# Altium project SeniorProject.PrjPCB
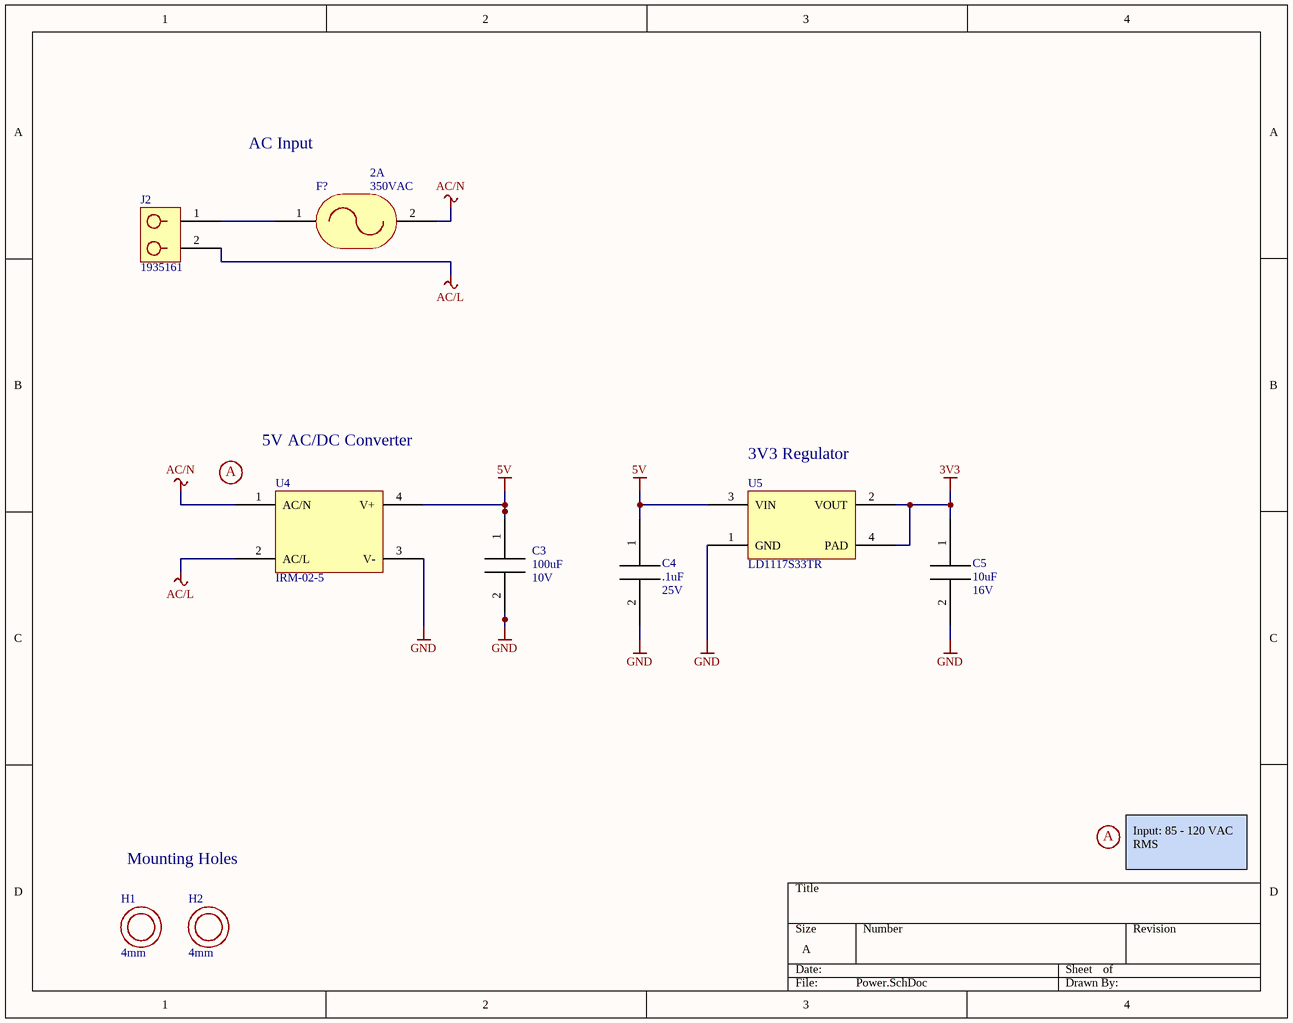
[diagram p0: Power.SchDoc]
3 sheets, 22 parts. Net scope: global (net labels, ports and power ports of the same name join across sheets).
Board file: LightSwitch.PcbDoc
Sheets:
  Power.SchDoc
  Dimmer.SchDoc
  XBee.SchDoc

## Sheet Power.SchDoc
size A

### Parts
C3  value 100uF  Rating: 10V  [1206]  (hidden comment: CAP)
C4  value .1uF  Rating: 25V  [1206]  (hidden comment: CAP)
C5  value 10uF  Rating: 16V  [1206]  (hidden comment: CAP)
F?  value 2A  Rating: 350VAC  [0697H]  (hidden comment: F_FUSE_0697H)
H1  value 4mm  [MOUNTHOLE4MM]  (hidden comment: H_MOUNTHOLE_MOUNTHOLE4MM)
H2  value 4mm  [MOUNTHOLE4MM]  (hidden comment: H_MOUNTHOLE_MOUNTHOLE4MM)
J2  1935161  [1935161]
U4  IRM-02-5  [IRM-02-5]
U5  LD1117S33TR  [SOT223]

### Nets
3V3: C5.1 U5.2(VOUT) U5.4(PAD)
5V: C3.1 C4.1 U4.4(V+) U5.3(VIN)
AC/L: J2.2 U4.2(AC/L)
AC/N: F?.2 U4.1(AC/N)
GND: C3.2 C4.2 C5.2 U4.3(V-) U5.1(GND)
NetF?_1: F?.1 J2.1

### Notes on the sheet
- AC Input
- (near U4) A
- 5V AC/DC Converter
- (near U5) 3V3 Regulator
- A
- Mounting Holes
- Input: 85 - 120 VAC RMS

### Library data of the parts
C3-C5 = C_CAP_1206
J2 = J_2POSTERM_1935161
U4 = U_IRM-02-5_IRM-02-5
U5 = U_LD1117S33TR_SOT223

## Sheet Dimmer.SchDoc
size A4
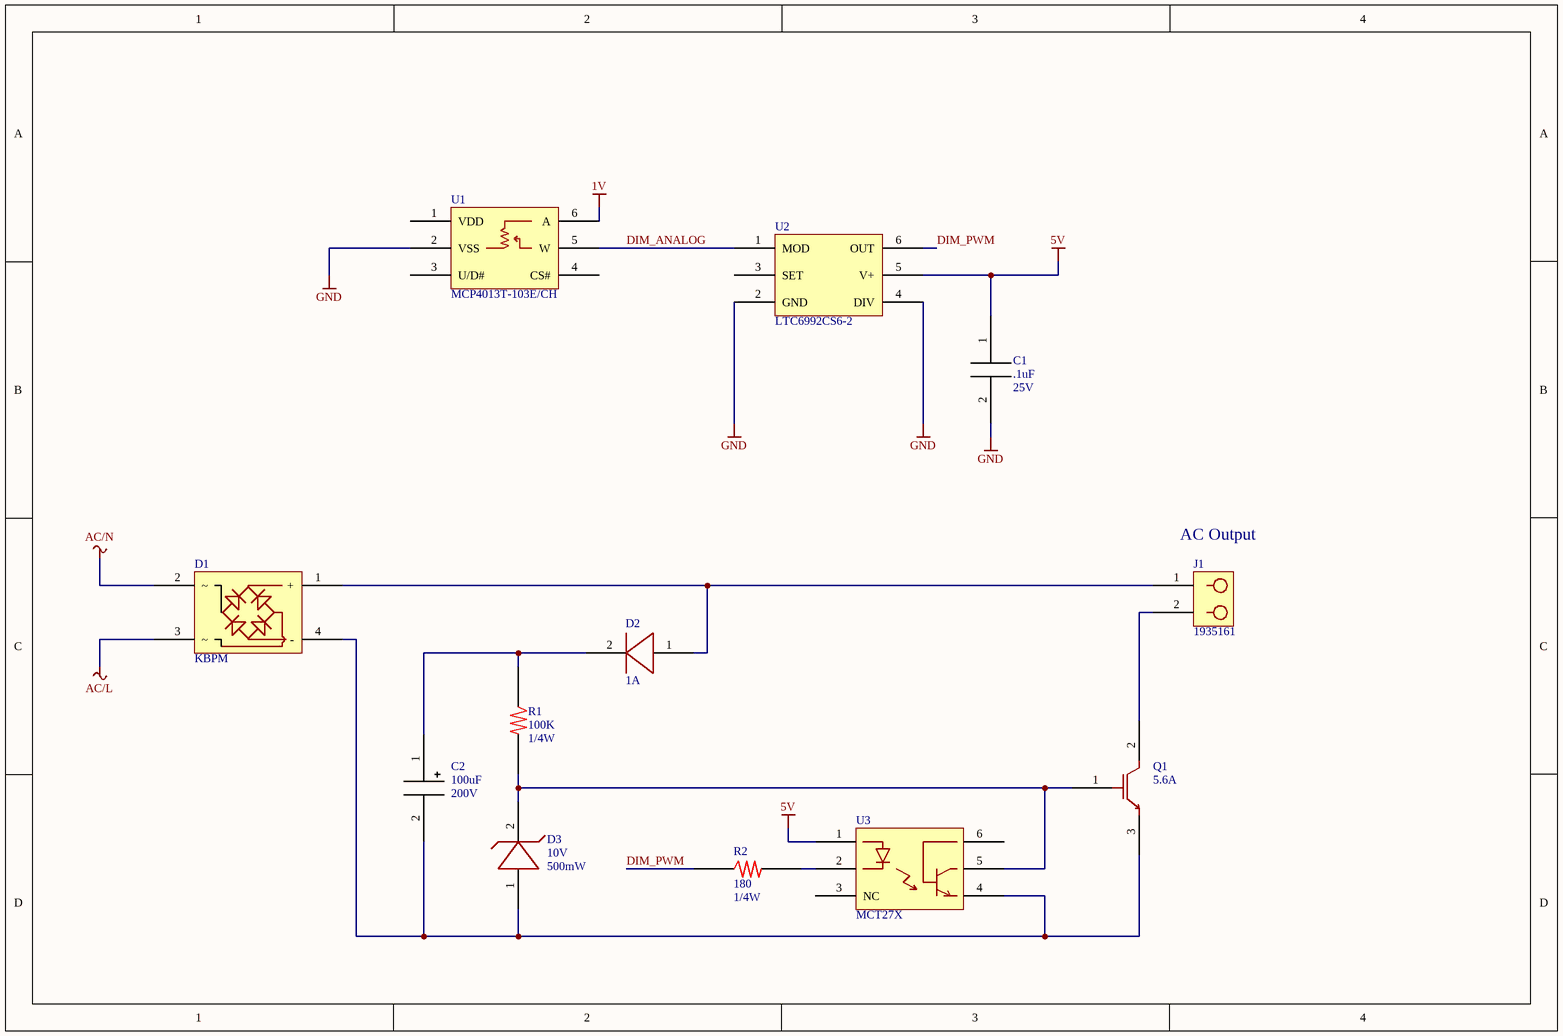
[diagram p1: Dimmer.SchDoc]

### Parts
C1  value .1uF  Rating: 25V  [1206]  (hidden comment: CAP)
C2  value 100uF  Rating: 200V  [CAPM7]  (hidden comment: CAP)
D1  KBPM  [KBPM]
D2  Rating: 1A  [DO41]  (hidden comment: DIODE)
D3  value 10V  Rating: 500mW  [DO35]  (hidden comment: ZENER)
J1  1935161  [1935161]
Q1  Rating: 5.6A  [TO-220AB]  (hidden comment: Q_IRF510_TO-220AB)
R1  value 100K  Rating: 1/4W  [1206]  (hidden comment: R_RES_1206)
R2  value 180  Rating: 1/4W  [1206]  (hidden comment: R_RES_1206)
U1  MCP4013T-103E/CH  [SOT23-6]
U2  LTC6992CS6-2  [SOT23-6]
U3  MCT27X  [DIP6]

### Nets
1V: U1.6(A)
5V: C1.1 U2.5(V+) U3.1
AC/L: D1.3
AC/N: D1.2
GND: C1.2 U1.2(VSS) U2.2(GND) U2.4(DIV)
DIM_ANALOG: U1.5(W) U2.1(MOD)
DIM_PWM: R2.1 U2.6(OUT)
NetC2_1: C2.1 D2.2 R1.1
NetC2_2: C2.2 D1.4(-) D3.1 Q1.3(S) U3.4
NetD1_1: D1.1(+) D2.1 J1.1
NetD3_2: D3.2 Q1.1(G) R1.2 U3.5
NetJ1_2: J1.2 Q1.2(D)
NetR2_2: R2.2 U3.2

Not connected (* = marked no-connect by the designer): U1 1(VDD) 3(U/D#) 4(CS#); U2 3(SET); U3 3(NC) 6

### Notes on the sheet
- (near J1) AC Output

### Library data of the parts
C1 = C_CAP_1206
C2 = C_CAPP_CAPM7
D1 = D_KBPM_KBMP
D2 = D_DIODE_DO41
D3 = D_ZENER_DO35
J1 = J_2POSTERM_1935161
U1 = U_ MCP4013T-103E/CH_SOT23-6
U2 = U_LTC6992CS6-2_SOT23-6
U3 = U_MCT27X_DIP6

## Sheet XBee.SchDoc
size A
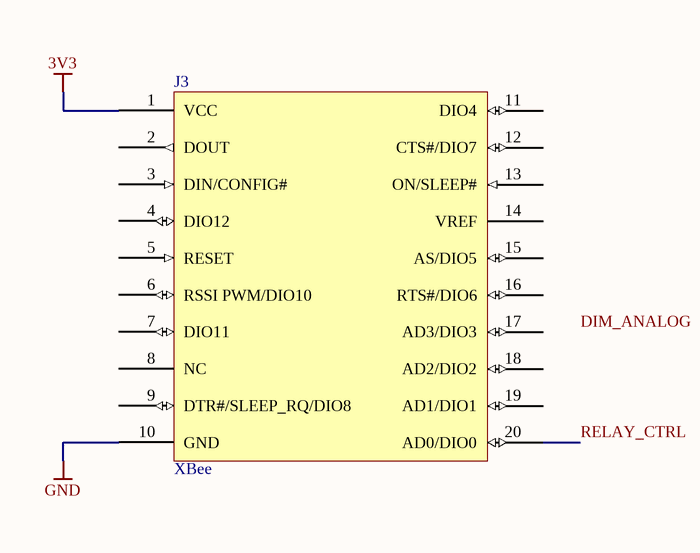
[diagram p2: XBee.SchDoc]

### Parts
J3  XBee  [XBEE]

### Nets
3V3: J3.1(VCC)
GND: J3.10(GND)
RELAY_CTRL: J3.20(AD0/DIO0)

Not connected (* = marked no-connect by the designer): J3 2(DOUT) 3(DIN/CONFIG#) 4(DIO12) 5(RESET) 6(RSSI_PWM/DIO10) 7(DIO11) 8(NC) 9(DTR#/SLEEP_RQ/DIO8) 11(DIO4) 12(CTS#/DIO7) 13(ON/SLEEP#) 14(VREF) 15(AS/DIO5) 16(RTS#/DIO6) 17(AD3/DIO3) 18(AD2/DIO2) 19(AD1/DIO1)

### Notes on the sheet
- Labels drawn without touching a wire or pin: DIM_ANALOG

### Library data of the parts
J3 = J_XBEE_XBEE

## Nets that join several sheets
3V3: Power (C5.1 U5.2 U5.4), XBee (J3.1)
5V: Power (C3.1 C4.1 U4.4 U5.3), Dimmer (C1.1 U2.5 U3.1)
AC/L: Power (J2.2 U4.2), Dimmer (D1.3)
AC/N: Power (F?.2 U4.1), Dimmer (D1.2)
GND: Power (5 pins), Dimmer (C1.2 U1.2 U2.2 U2.4), XBee (J3.10)